# Altium schematic sheet usb.SchDoc
size A3
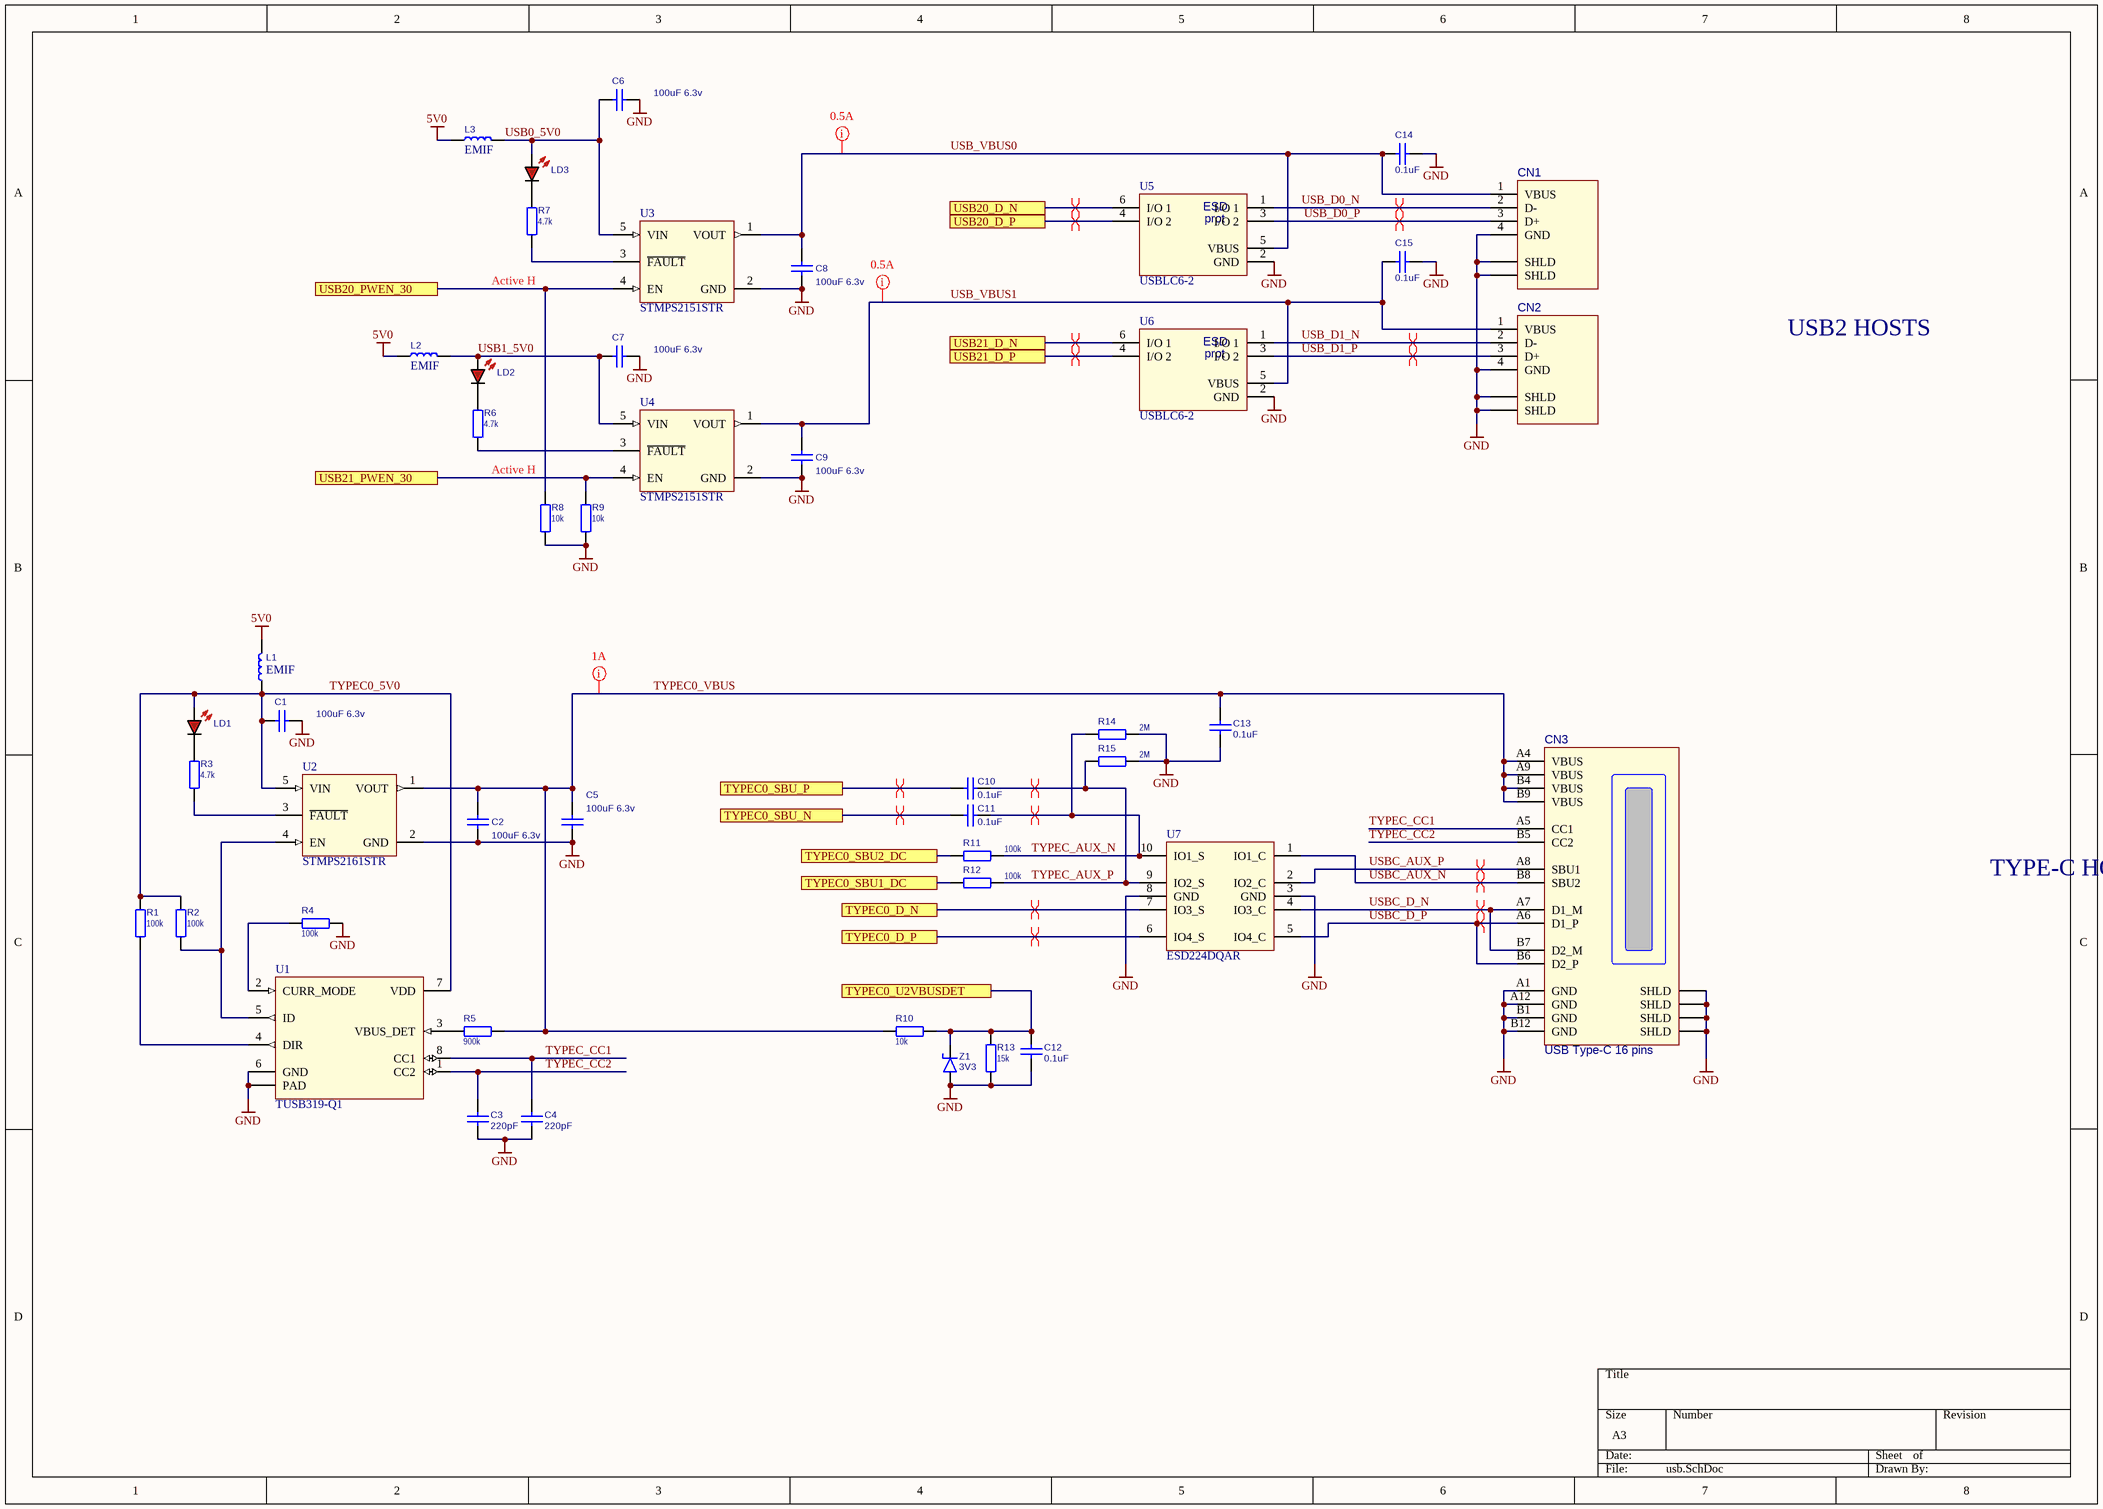
[diagram p0: usb.SchDoc]

## Parts
C1  value 100uF 6.3v  [C1206]  (hidden comment: CL31A107MQHNNNE)
C2  value 100uF 6.3v  [C1206]  (hidden comment: CL31A107MQHNNNE)
C3  value 220pF  [C0603]  (hidden comment: CL10C221JB8NNNC)
C4  value 220pF  [C0603]  (hidden comment: CL10C221JB8NNNC)
C5  value 100uF 6.3v  [C1206]  (hidden comment: CL31A107MQHNNNE)
C6  value 100uF 6.3v  [C1206]  (hidden comment: CL31A107MQHNNNE)
C7  value 100uF 6.3v  [C1206]  (hidden comment: CL31A107MQHNNNE)
C8  value 100uF 6.3v  [C1206]  (hidden comment: CL31A107MQHNNNE)
C9  value 100uF 6.3v  [C1206]  (hidden comment: CL31A107MQHNNNE)
C10  value 0.1uF  [C0603]  (hidden comment: C1608X7R1H104K080AA)
C11  value 0.1uF  [C0603]  (hidden comment: C1608X7R1H104K080AA)
C12  value 0.1uF  [C0603]  (hidden comment: C1608X7R1H104K080AA)
C13  value 0.1uF  [C0603]  (hidden comment: C1608X7R1H104K080AA)
C14  value 0.1uF  [C0603]  (hidden comment: C1608X7R1H104K080AA)
C15  value 0.1uF  [C0603]  (hidden comment: C1608X7R1H104K080AA)
CN1  USB Type-A Single  [USB-A-SINGLE]  (value not drawn)
CN2  USB Type-A Single  [USB-A-SINGLE]  (value not drawn)
CN3  USB Type-C 16 pins  [USB-C-16P]
L1  value EMIF  [IND0805]  (hidden comment: BLM21PG221SN1D)
L2  value EMIF  [IND0805]  (hidden comment: BLM21PG221SN1D)
L3  value EMIF  [IND0805]  (hidden comment: BLM21PG221SN1D)
LD1  LED_R  [R0805]  (value not drawn)
LD2  LED_R  [R0805]  (value not drawn)
LD3  LED_R  [R0805]  (value not drawn)
R1  100k  [R0603]
R2  100k  [R0603]
R3  4.7k  [R0603]
R4  100k  [R0603]
R5  900k  [R0603]
R6  4.7k  [R0603]
R7  4.7k  [R0603]
R8  10k  [R0603]
R9  10k  [R0603]
R10  10k  [R0603]
R11  100k  [R0603]
R12  100k  [R0603]
R13  15k  [R0603]
R14  2M  [R0603]
R15  2M  [R0603]
U1  TUSB319-Q1  [PWSON-8]
U2  STMPS2161STR  [SOT-23-5]
U3  STMPS2151STR  [SOT-23-5]
U4  STMPS2151STR  [SOT-23-5]
U5  USBLC6-2  [SOT-23-6]
U6  USBLC6-2  [SOT-23-6]
U7  ESD224DQAR  [USON-10]
Z1  value 3V3  [SOD-80C]  (hidden comment: BZV55-C3V3.115)

## Ports
TYPEC0_D_N, TYPEC0_D_P, TYPEC0_SBU1_DC, TYPEC0_SBU2_DC, TYPEC0_SBU_N, TYPEC0_SBU_P, TYPEC0_U2VBUSDET, USB20_D_N, USB20_D_P, USB20_PWEN_30, USB21_D_N, USB21_D_P, USB21_PWEN_30

## Nets
5V0: L1.1 L2.2 L3.2
GND: C1.1 C2.1 C3.2 C4.2 C5.1 C6.1 C7.1 C8.1 C9.1 C12.2 C13.2 C14.2 C15.2 CN1.4(GND) CN1.5(SHLD) CN1.6(SHLD) CN2.4(GND) CN2.5(SHLD) CN2.6(SHLD) CN3.1(SHLD) CN3.2(SHLD) CN3.3(SHLD) CN3.4(SHLD) CN3.A1(GND) CN3.A12(GND) CN3.B1(GND) CN3.B12(GND) R4.1 R8.2 R9.2 R13.1 R14.1 R15.1 U1.6(GND) U1.9(PAD) U2.2(GND) U3.2(GND) U4.2(GND) U5.2(GND) U6.2(GND) U7.3(GND) U7.8(GND) Z1.1(A)
TYPEC0_5V0: C1.2 L1.2 LD1.2 R1.2 R2.2 U1.7(VDD) U2.5(VIN)
TYPEC0_D_N: U7.7(IO3_S) ; port TYPEC0_D_N
TYPEC0_D_P: U7.6(IO4_S) ; port TYPEC0_D_P
TYPEC0_SBU1_DC: R12.2 ; port TYPEC0_SBU1_DC
TYPEC0_SBU2_DC: R11.2 ; port TYPEC0_SBU2_DC
TYPEC0_SBU_N: C11.2 ; port TYPEC0_SBU_N
TYPEC0_SBU_P: C10.2 ; port TYPEC0_SBU_P
TYPEC0_U2VBUSDET: C12.1 R10.2 R13.2 Z1.2(K) ; port TYPEC0_U2VBUSDET
TYPEC0_VBUS: C2.2 C5.2 C13.1 CN3.A4(VBUS) CN3.A9(VBUS) CN3.B4(VBUS) CN3.B9(VBUS) R5.2 R10.1 U2.1(VOUT)
TYPEC_AUX_N: C11.1 R11.1 R14.2 U7.10(IO1_S)
TYPEC_AUX_P: C10.1 R12.1 R15.2 U7.9(IO2_S)
TYPEC_CC1: C4.1 CN3.A5(CC1) U1.8(CC1)
TYPEC_CC2: C3.1 CN3.B5(CC2) U1.1(CC2)
USB0_5V0: C6.2 L3.1 LD3.2 U3.5(VIN)
USB1_5V0: C7.2 L2.1 LD2.2 U4.5(VIN)
USB20_D_N: U5.6(I/O_1) ; port USB20_D_N
USB20_D_P: U5.4(I/O_2) ; port USB20_D_P
USB20_PWEN_30: R8.1 U3.4(EN) ; port USB20_PWEN_30
USB21_D_N: U6.6(I/O_1) ; port USB21_D_N
USB21_D_P: U6.4(I/O_2) ; port USB21_D_P
USB21_PWEN_30: R9.1 U4.4(EN) ; port USB21_PWEN_30
USB_D0_N: CN1.2(D-) U5.1(I/O_1)
USB_D0_P: CN1.3(D+) U5.3(I/O_2)
USB_D1_N: CN2.2(D-) U6.1(I/O_1)
USB_D1_P: CN2.3(D+) U6.3(I/O_2)
USB_VBUS0: C8.2 C14.1 CN1.1(VBUS) U3.1(VOUT) U5.5(VBUS)
USB_VBUS1: C9.2 C15.1 CN2.1(VBUS) U4.1(VOUT) U6.5(VBUS)
USBC_AUX_N: CN3.B8(SBU2) U7.1(IO1_C)
USBC_AUX_P: CN3.A8(SBU1) U7.2(IO2_C)
USBC_D_N: CN3.A7(D1_M) CN3.B7(D2_M) U7.4(IO3_C)
USBC_D_P: CN3.A6(D1_P) CN3.B6(D2_P) U7.5(IO4_C)
NetLD1_1: LD1.1 R3.2
NetLD2_1: LD2.1 R6.1
NetLD3_1: LD3.1 R7.2
NetR1_1: R1.1 U1.4(DIR)
NetR2_1: R2.1 U1.5(ID) U2.4(EN)
NetR3_1: R3.1 U2.3(~{FAULT})
NetR4_2: R4.2 U1.2(CURR_MODE)
NetR5_1: R5.1 U1.3(VBUS_DET)
NetR6_2: R6.2 U4.3(~{FAULT})
NetR7_1: R7.1 U3.3(~{FAULT})

## Layout directives
differential pair: TYPEC0_D_N, TYPEC0_D_P, TYPEC0_SBU_N, TYPEC0_SBU_P, TYPEC_AUX_N, TYPEC_AUX_P, USB20_D_N, USB20_D_P, USB21_D_N, USB21_D_P, USB_D0_N, USB_D0_P, USB_D1_N, USB_D1_P, USBC_AUX_N, USBC_AUX_P, USBC_D_N, USBC_D_P
mark named 0.5A: USB_VBUS0, USB_VBUS1
mark named 1A: TYPEC0_VBUS

## Notes on the sheet
- (near R7) Active H
- USB2 HOSTS
- Active H
- TYPE-C HOST (USB 2.0)
- (in symbol USBLC6-2) ESD; prot

## Library data of the parts
C1-C15 = CAP_NPOL
CN1 CN2 = USB-A-SINGLE: Value: KLS1-181A
CN3 = USB-C-16: Value: USB Type-C
L1-L3 = IND_WO_IRON
LD1-LD3 = LED_RED: LED Red; Value: *
R1-R15 = RESISTOR: RES
  R1 R2 R4 R11 R12: Value: 100k
  R3 R6 R7: Value: 4.7k
  R5: Value: 900k
  R8-R10: Value: 10k
  R13: Value: 15k
  R14 R15: Value: 2M
U1 = TUSB319: TUSB319-Q1 USB Type-C DFP Port Controller; value: TUSB319-Q1
U2-U4 = STMPS21x1STR: value: STMPS21x1STR
U5 U6 = USBLC6-2: Ultralow capacitance ESD protection; value: USBLC6-2
U7 = ESD224: ESD224 Low Clamping 4-Channel ESD Protection Device for HDMI Interface; value: ESD224
Z1 = ZENNER_1: ZENNER